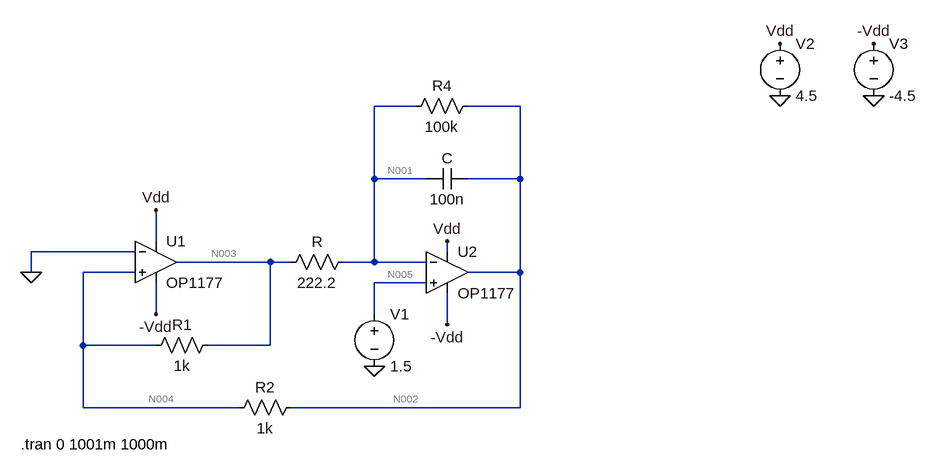
[diagram p0: schematic Draft2.asc]
Draft2.asc, the LTspice schematic file:
Version 4.1
SHEET 1 1320 680
WIRE 496 -128 432 -128
WIRE 656 -128 576 -128
WIRE 432 -16 432 -128
WIRE 512 -16 432 -16
WIRE 656 -16 656 -128
WIRE 656 -16 576 -16
WIRE 96 80 96 32
WIRE 64 96 -96 96
WIRE 544 96 544 80
WIRE 272 112 128 112
WIRE 304 112 272 112
WIRE 432 112 432 -16
WIRE 432 112 384 112
WIRE 512 112 432 112
WIRE -96 128 -96 96
WIRE 64 128 -16 128
WIRE 656 128 656 -16
WIRE 656 128 576 128
WIRE 512 144 432 144
WIRE 96 192 96 144
WIRE 432 192 432 144
WIRE 544 208 544 160
WIRE -16 240 -16 128
WIRE 96 240 -16 240
WIRE 272 240 272 112
WIRE 272 240 176 240
WIRE -16 336 -16 240
WIRE 224 336 -16 336
WIRE 656 336 656 128
WIRE 656 336 304 336
FLAG -96 128 0
FLAG 432 272 0
FLAG 1056 -144 0
FLAG 1200 -144 0
FLAG 1056 -224 Vdd
FLAG 96 32 Vdd
FLAG 544 80 Vdd
FLAG 1200 -224 -Vdd
FLAG 544 208 -Vdd
FLAG 96 192 -Vdd
SYMBOL OpAmps\\OP1177 96 48 R0
SYMATTR InstName U1
SYMBOL OpAmps\\OP1177 544 64 R0
SYMATTR InstName U2
SYMBOL res 192 224 R90
WINDOW 0 0 56 VBottom 2
WINDOW 3 32 56 VTop 2
SYMATTR InstName R1
SYMATTR Value 1k
SYMBOL res 320 320 R90
WINDOW 0 0 56 VBottom 2
WINDOW 3 32 56 VTop 2
SYMATTR InstName R2
SYMATTR Value 1k
SYMBOL res 400 96 R90
WINDOW 0 0 56 VBottom 2
WINDOW 3 32 56 VTop 2
SYMATTR InstName R
SYMATTR Value 222.2
SYMBOL cap 576 -32 R90
WINDOW 0 0 32 VBottom 2
WINDOW 3 32 32 VTop 2
SYMATTR InstName C
SYMATTR Value 100n
SYMBOL voltage 432 176 R0
SYMATTR InstName V1
SYMATTR Value 1.5
SYMBOL res 592 -144 R90
WINDOW 0 0 56 VBottom 2
WINDOW 3 32 56 VTop 2
SYMATTR InstName R4
SYMATTR Value 100k
SYMBOL voltage 1056 -240 R0
SYMATTR InstName V2
SYMATTR Value 4.5
SYMBOL voltage 1200 -240 R0
SYMATTR InstName V3
SYMATTR Value -4.5
TEXT -112 392 Left 2 !.tran 0 1001m 1000m

The netlist it stands for:
* Draft2.asc
X§U1 N004 0 Vdd -Vdd N003 OP1177  ; pins In+ In- V+ V- OUT
X§U2 N005 N001 Vdd -Vdd N002 OP1177  ; pins In+ In- V+ V- OUT
R1 N003 N004 1k
R2 N002 N004 1k
R N001 N003 222.2
C N002 N001 100n
V1 N005 0 1.5
R4 N002 N001 100k
V2 Vdd 0 4.5
V3 -Vdd 0 -4.5
.tran 0 1001m 1000m
.lib ADI1.lib
.backanno
.end

* Results of the author's LTspice run, read from the files saved beside the schematic
* Operating Point, zero values left out:
*   V(vdd) = 4.5 V
*   V(n003) = 1.507 V
*   V(n005) = 1.5 V
*   V(n002) = -1.507 V
*   V(n004) = 29.45 µV
*   V(-vdd) = -4.5 V
*   V(n001) = 1.5 V
*   I(R2) = -1.507 mA
*   I(V1) = 1.989 nA
*   I(V2) = -1.759 mA
*   I(R4) = -30.07 µA
*   I(R1) = 1.507 mA
*   I(R) = -30.06 µA
*   I(V3) = 1.759 mA
*   Ix(u2:1) = -1.989 nA
*   Ix(u2:2) = -1.989 nA
*   Ix(u2:3) = 128.2 µA
*   Ix(u2:4) = -1.665 mA
*   Ix(u2:5) = 1.537 mA
*   Ix(u1:1) = -2 nA
*   Ix(u1:2) = -2 nA
*   Ix(u1:3) = 1.631 mA
*   Ix(u1:4) = -94.14 µA
*   Ix(u1:5) = -1.537 mA
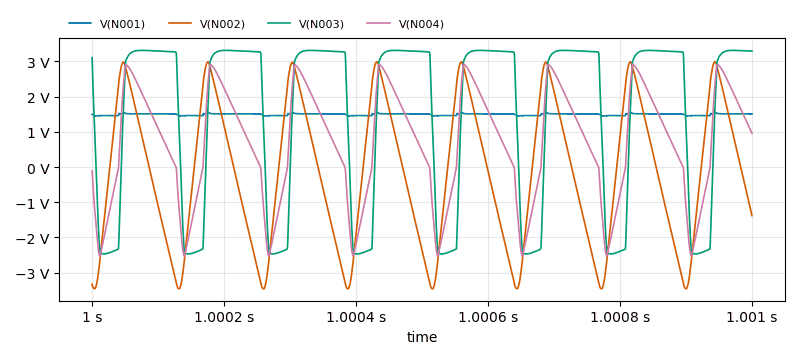
[diagram p1: Transient Analysis of Draft2.asc, plotted from the saved traces]
* Transient Analysis, 1 run:
*   V(N001): min 1.447 V, max 1.552 V, average 1.496 V, rms 1.496 V, last 1.51 V
*   V(N002): min -3.46 V, max 2.993 V, average -189.3 mV, rms 2.015 V, last -1.381 V
*   V(N003): min -2.469 V, max 3.316 V, average 1.457 V, rms 2.866 V, last 3.294 V
*   V(N004): min -2.535 V, max 2.92 V, average 633.8 mV, rms 1.734 V, last 956.4 mV